# Altium project HP45 BOARD.PrjPcb
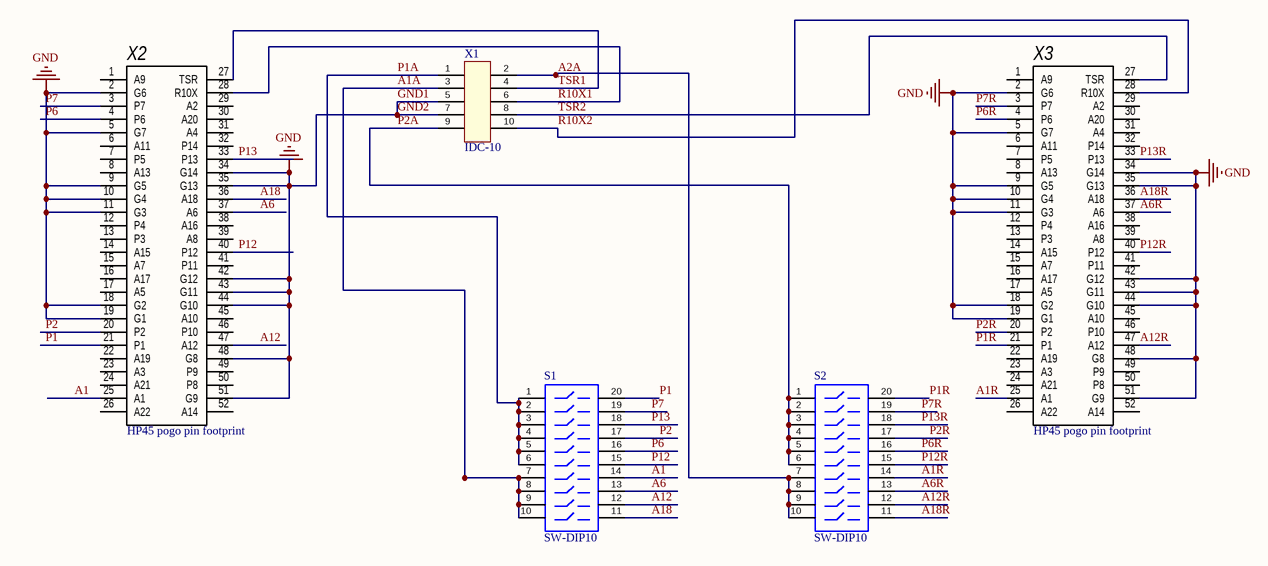
[diagram p0: hp45BR.SchDoc]
1 sheet, 5 parts. Net scope: global (net labels, ports and power ports of the same name join across sheets).
Board file: PCB.PcbDoc

## Sheet hp45BR.SchDoc
size 594 x 420 mm; ApprovedBy: Утвердил; CheckedBy: Морозов М.С.; Author: Сим Н.К.; CompanyName: ИЦ АСК; DrawnBy: Н.Контр; Engineer: Т.Контр; SheetNumber: 1; SheetTotal: 8; PageSetup: Record=PageOptions|CenterHorizontal=True|CenterVertical=True|PrintScale=0.94|XCorrection=1.00|YCorrection=1.00|PrintKind=1|BorderSize=5000000|LeftOffset=0|BottomOffset=0|Orientation=1|PaperLength=1000|PaperWidth=1000|Scale=100|PaperSource=7|PrintQuality=-4|MediaType=1|DitherType=10|PaperKind=A4|PrintScaleMode=1; DecimalNumber: HP45 BRD; HeadOfSector: Нач. сектора; MainDevice: Перв.примен.; Name: Плата для 2-х картриджей HP45; DocumentName: Sheet1.SCHDOC; Rule: PcbType=ProtelPcb

### Parts
S1  SW-DIP10  [DIP-20-KEY]
S2  SW-DIP10  [DIP-20-KEY]
X1  IDC-10  [IDC-10]
X2  HP45 pogo pin footprint  [HP45]
X3  HP45 pogo pin footprint  [HP45]

### Nets
GND1: X1.5 X1.7 X2.2(G6) X2.5(G7) X2.9(G5) X2.10(G4) X2.11(G3) X2.18(G2) X2.19(G1) X2.34(G14) X2.35(G13) X2.42(G12) X2.43(G11) X2.44(G10) X2.48(G8) X2.51(G9) X3.2(G6) X3.5(G7) X3.9(G5) X3.10(G4) X3.11(G3) X3.18(G2) X3.19(G1) X3.34(G14) X3.35(G13) X3.42(G12) X3.43(G11) X3.44(G10) X3.48(G8) X3.51(G9)  [also labelled GND, GND2]
A1: S1.14 X2.25(A1)
A1A: S1.7 S1.8 S1.9 S1.10 X1.3
A1R: S2.14 X3.25(A1)
A2A: S2.7 S2.8 S2.9 S2.10 X1.2
A6: S1.13 X2.37(A6)
A6R: S2.13 X3.37(A6)
A12: S1.12 X2.47(A12)
A12R: S2.12 X3.47(A12)
A18: S1.11 X2.36(A18)
A18R: S2.11 X3.36(A18)
P1: S1.20 X2.21(P1)
P1A: S1.1 S1.2 S1.3 S1.4 S1.5 S1.6 X1.1
P1R: S2.20 X3.21(P1)
P2: S1.17 X2.20(P2)
P2A: S2.1 S2.2 S2.3 S2.4 S2.5 S2.6 X1.9
P2R: S2.17 X3.20(P2)
P6: S1.16 X2.4(P6)
P6R: S2.16 X3.4(P6)
P7: S1.19 X2.3(P7)
P7R: S2.19 X3.3(P7)
P12: S1.15 X2.40(P12)
P12R: S2.15 X3.40(P12)
P13: S1.18 X2.33(P13)
P13R: S2.18 X3.33(P13)
R10X1: X1.6 X2.28(R10X)
R10X2: X1.10 X3.28(R10X)
TSR1: X1.4 X2.27(TSR)
TSR2: X1.8 X3.27(TSR)

Not connected (* = marked no-connect by the designer): X2 1(A9) 6(A11) 7(P5) 8(A13) 12(P4) 13(P3) 14(A15) 15(A7) 16(A17) 17(A5) 22(A19) 23(A3) 24(A21) 26(A22) 29(A2) 30(A20) 31(A4) 32(P14) 38(A16) 39(A8) 41(P11) 45(A10) 46(P10) 49(P9) 50(P8) 52(A14); X3 1(A9) 6(A11) 7(P5) 8(A13) 12(P4) 13(P3) 14(A15) 15(A7) 16(A17) 17(A5) 22(A19) 23(A3) 24(A21) 26(A22) 29(A2) 30(A20) 31(A4) 32(P14) 38(A16) 39(A8) 41(P11) 45(A10) 46(P10) 49(P9) 50(P8) 52(A14)

### Notes on the sheet
- Перв.примен.
- Справ.№
- Подп. и дата
- Инв.№ дубл.
- Взам.инв.№
- Подп.и дата
- Разраб.
- Изм.
- Лист
- № докум.
- Подп.
- Дата
- Лит.
- Масштаб
- Масса
- Т.контр.
- Пров.
- ПРИНЦИПИАЛЬНАЯ
- СХЕМА   ЭЛЕКТРИЧЕСКАЯ
- Листов
- Инв.№ подл.
- Утв.
- Н.контр.
- Нач.сект.
- Формат  A2

### Library data of the parts
S1 S2 = SW-DIP10: 4009 Series DIP Switch, Raised actuator; Published: 24-Mar-1999; LatestRevisionDate: 17-Dec-2003; LatestRevisionNote: PCB Footprint replaced.; PackageReference: DIP-16-KEY; Publisher: Altium Limited; PackageDescription: DIP; 16 Leads; Row Spacing 7.62 mm; Pitch 2.54 mm; ComponentLink1Description: Manufacturer Link; ComponentLink1URL: http://www.oupiin.com/prodindx.html#Headers
X1 = IDC-10: разъем 4130
X2 X3 = HP45